# Altium project STM32_Project_1.PrjPcb
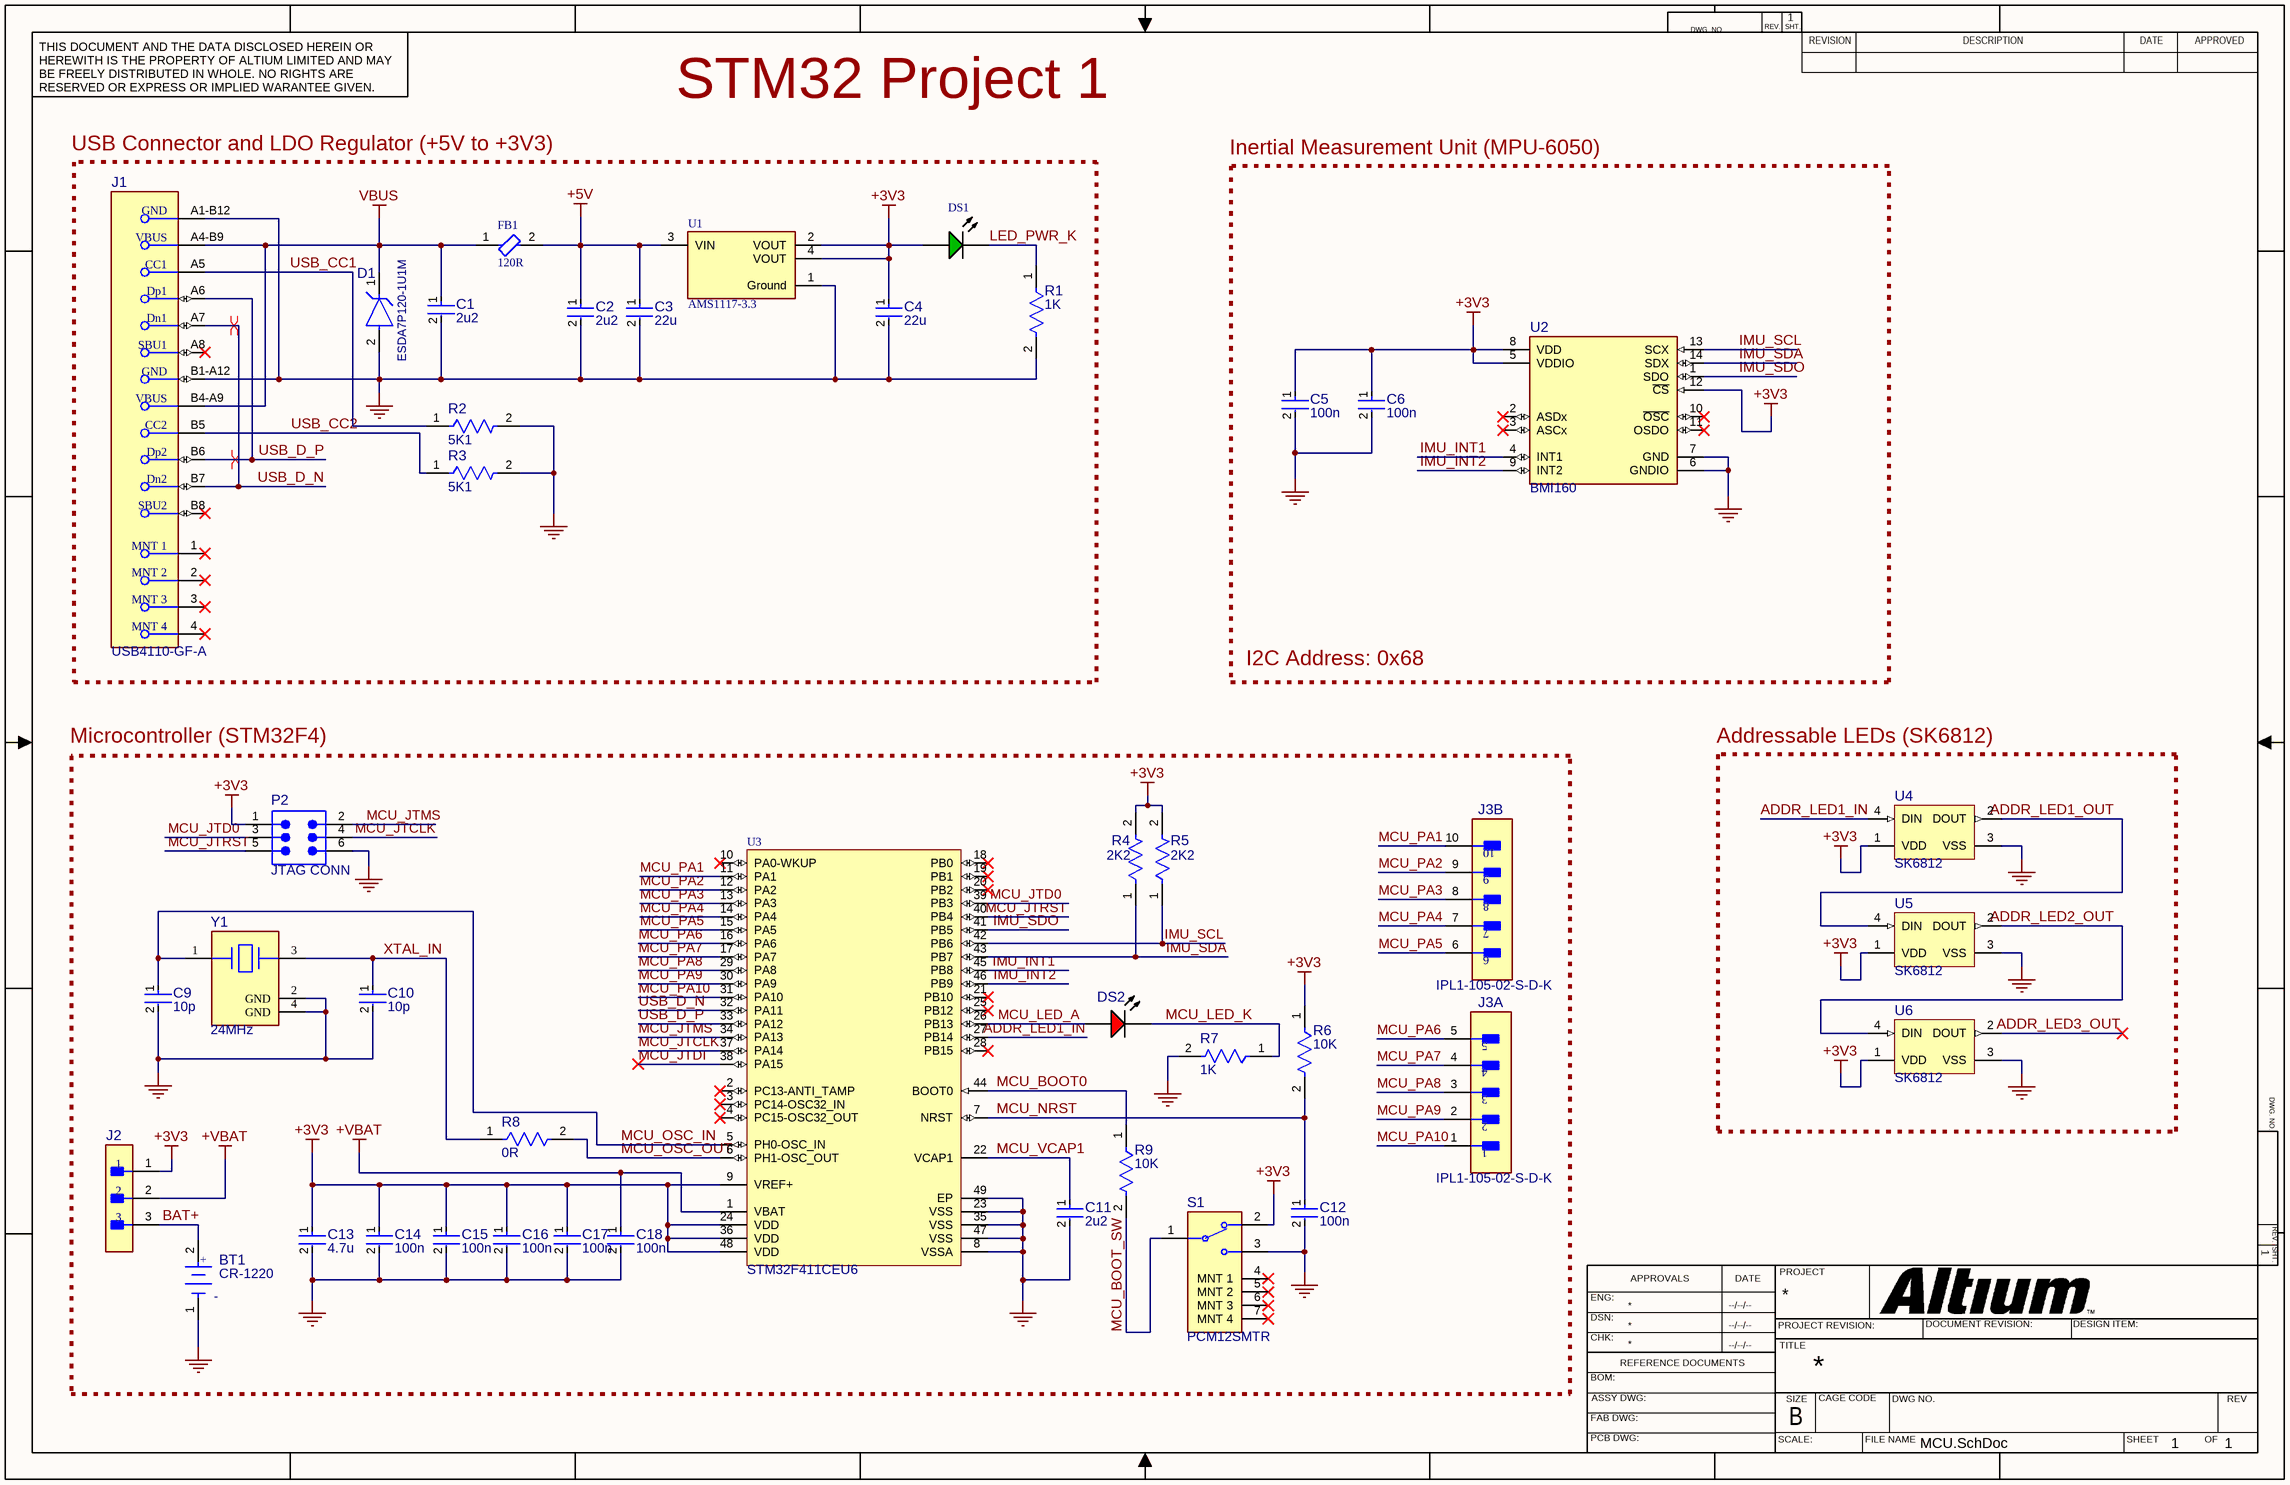
[diagram p0: MCU.SchDoc]
1 sheet, 42 parts. Net scope: global (net labels, ports and power ports of the same name join across sheets).
Board file: PCB1.PcbDoc

## Sheet MCU.SchDoc
size 431 x 279 mm; Author: Ibrahim Oladepo; Revision: -; SheetNumber: 1; SheetTotal: 1; ENG_APP_DATE: --/--/--; DSN_APP_DATE: --/--/--; CHK_APP_DATE: --/--/--

### Parts
BT1  CR-1220  [FP-S8411-45R-MFG]
C1  2u2  [FP-0805-L_2_01_0_2-W_1_25-IPC_B]
C2  2u2  [FP-0805-L_2_01_0_2-W_1_25-IPC_B]
C3  22u  [FP-CC0805-0_85-MFG]
C4  22u  [FP-CC0805-0_85-MFG]
C5  100n  [FP-CC0805-0_85-MFG]
C6  100n  [FP-CC0805-0_85-MFG]
C9  10p  [FP-CC0805-0_85-MFG]
C10  10p  [FP-CC0805-0_85-MFG]
C11  2u2  [FP-0805-L_2_01_0_2-W_1_25-IPC_B]
C12  100n  [FP-CC0805-0_85-MFG]
C13  4.7u  [FP-0805-L_2_01_0_2-W_1_25-MFG]
C14  100n  [FP-CC0805-0_85-MFG]
C15  100n  [FP-CC0805-0_85-MFG]
C16  100n  [FP-CC0805-0_85-MFG]
C17  100n  [FP-CC0805-0_85-MFG]
C18  100n  [FP-CC0805-0_85-MFG]
D1  ESDA7P120-1U1M  [FP-QFN1610-MFG]
DS1  1K  [AVAG-HSMX-C170_V]  (value not drawn)
DS2  LTST-C170KRKT  [LTST-C170KRKT_V]  (value not drawn)
FB1  120R  [FP-BLM21-0_2-t0_85-e0_5-IPC_A]
J1  USB4110-GF-A  [FP-USB4110-GF-A-MFG]
J2  5-146128-1  [FP-5-146128-1-MFG]  (value not drawn)
J3  IPL1-105-02-S-D-K  [FP-IPL1-105-02-S-D-K-0]  (parts A,B of 2)
P2  JTAG CONN  [61000621121]
R1  1K  [FP-CRCW0805-e3-IPC_A]
R2  5K1  [FP-CRCW0805-e3-IPC_A]
R3  5K1  [FP-CRCW0805-e3-IPC_A]
R4  2K2  [FP-CRCW0805-e3-IPC_A]
R5  2K2  [FP-CRCW0805-e3-IPC_A]
R6  10K  [FP-CRCW0805-e3-IPC_A]
R7  1K  [FP-CRCW0805-e3-IPC_A]
R8  0R  [FP-CRCW0805-e3-IPC_A]
R9  10K  [FP-CRCW0805-e3-IPC_A]
S1  PCM12SMTR  [FP-PCM12SMTR-MFG]
U1  AMS1117-3.3  [FP-AMS1117-IPC_C]
U2  BMI160  [FP-BMI160-MFG]
U3  STM32F411CEU6  [STM-UFQFPN48_L]
U4  SK6812  [ADA-RGB-1655_V]
U5  SK6812  [ADA-RGB-1655_V]
U6  SK6812  [ADA-RGB-1655_V]
Y1  24MHz  [FP-ABM8G-MFG]

### Blocks framed on the sheet
USB Connector and LDO Regulator (+5V to +3V3): C1-C4 D1 DS1 FB1 J1 R1-R3 U1
Microcontroller (STM32F4): BT1 C9-C18 DS2 J2 J3 P2 R4-R9 S1 U3 Y1
Addressable LEDs (SK6812): U4-U6

### Nets
+3V3: C4.1 C5.1 C6.1 C13.1 C14.1 C15.1 C16.1 C17.1 DS1.1(A) J2.1 P2.1 R4.2 R5.2 R6.1 S1.2 U1.2(VOUT) U1.4(VOUT) U2.5(VDDIO) U2.8(VDD) U2.12(~{CS}) U3.9(VREF+) U3.24(VDD) U3.36(VDD) U3.48(VDD) U4.1(VDD) U5.1(VDD) U6.1(VDD)
+5V: C2.1 C3.1 FB1.2 U1.3(VIN)
+VBAT: C18.1 J2.2 U3.1(VBAT)
GND: BT1.1(C) C1.2 C2.2 C3.2 C4.2 C5.2 C6.2 C9.2 C10.2 C11.2 C12.2 C13.2 C14.2 C15.2 C16.2 C17.2 C18.2 D1.2(A) J1.A1-B12(GND) J1.B1-A12(GND) P2.6 R1.2 R2.2 R3.2 R7.2 S1.3 U1.1(Ground) U2.6(GNDIO) U2.7(GND) U3.8(VSSA) U3.23(VSS) U3.35(VSS) U3.47(VSS) U3.49(EP) U4.3(VSS) U5.3(VSS) U6.3(VSS) Y1.2(GND) Y1.4(GND)
VBUS: C1.1 D1.1(C) FB1.1 J1.A4-B9(VBUS) J1.B4-A9(VBUS)
ADDR_LED1_IN: U3.27(PB14) U4.4(DIN)
ADDR_LED1_OUT: U4.2(DOUT) U5.4(DIN)
ADDR_LED2_OUT: U5.2(DOUT) U6.4(DIN)
ADDR_LED3_OUT: U6.2(DOUT)
BAT+: BT1.2(A) J2.3
IMU_INT1: U2.4(INT1) U3.45(PB8)
IMU_INT2: U2.9(INT2) U3.46(PB9)
IMU_SCL: R5.1 U2.13(SCX) U3.42(PB6)
IMU_SDA: R4.1 U2.14(SDX) U3.43(PB7)
IMU_SDO: U2.1(SDO) U3.41(PB5)
LED_PWR_K: DS1.2(K) R1.1
MCU_BOOT0: R9.1 U3.44(BOOT0)
MCU_BOOT_SW: R9.2 S1.1
MCU_JTCLK: P2.4 U3.37(PA14)
MCU_JTD0: P2.3 U3.39(PB3)
MCU_JTDI: U3.38(PA15)
MCU_JTMS: P2.2 U3.34(PA13)
MCU_JTRST: P2.5 U3.40(PB4)
MCU_LED_A: DS2.1(A) U3.26(PB13)
MCU_LED_K: DS2.2(K) R7.1
MCU_NRST: C12.1 R6.2 U3.7(NRST)
MCU_OSC_IN: C9.1 U3.5(PH0-OSC_IN) Y1.1
MCU_OSC_OUT: R8.2 U3.6(PH1-OSC_OUT)
MCU_PA1: J3.10 U3.11(PA1)
MCU_PA2: J3.9 U3.12(PA2)
MCU_PA3: J3.8 U3.13(PA3)
MCU_PA4: J3.7 U3.14(PA4)
MCU_PA5: J3.6 U3.15(PA5)
MCU_PA6: J3.5 U3.16(PA6)
MCU_PA7: J3.4 U3.17(PA7)
MCU_PA8: J3.3 U3.29(PA8)
MCU_PA9: J3.2 U3.30(PA9)
MCU_PA10: J3.1 U3.31(PA10)
MCU_VCAP1: C11.1 U3.22(VCAP1)
USB_CC1: J1.A5(CC1) R2.1
USB_CC2: J1.B5(CC2) R3.1
USB_D_N: J1.A7(Dn1) J1.B7(Dn2) U3.32(PA11)
USB_D_P: J1.A6(Dp1) J1.B6(Dp2) U3.33(PA12)
XTAL_IN: C10.1 R8.1 Y1.3

Not connected (* = marked no-connect by the designer): J1 1(MNT_1)* 2(MNT_2)* 3(MNT_3)* 4(MNT_4)* A8(SBU1)* B8(SBU2)*; S1 4(MNT_1)* 5(MNT_2)* 6(MNT_3)* 7(MNT_4)*; U2 2(ASDx)* 3(ASCx)* 10(~{OSC})* 11(OSDO)*; U3 2(PC13-ANTI_TAMP)* 3(PC14-OSC32_IN)* 4(PC15-OSC32_OUT)* 10(PA0-WKUP)* 18(PB0)* 19(PB1)* 20(PB2)* 21(PB10)* 25(PB12)* 28(PB15)*

### Layout directives
differential pair; net class DIFF_USB: USB_D_N, USB_D_P

### Notes on the sheet
- STM32 Project 1
- Inertial Measurement Unit (MPU-6050)
- I2C Address: 0x68
- DWG. NO.
- REV.
- SHT.
- THIS DOCUMENT AND THE DATA DISCLOSED HEREIN OR HEREWITH IS THE PROPERTY OF ALTIUM LIMITED AND MAY BE FREELY DISTRIBUTED IN WHOLE. NO RIGHTS ARE RESERVED OR EXPRESS OR IMPLIED WARANTEE GIVEN.
- REVISION
- DESCRIPTION
- DATE
- APPROVED
- ENG:
- APPROVALS
- PROJECT
- DSN:
- CHK:
- REFERENCE DOCUMENTS
- PROJECT REVISION:
- TITLE
- DOCUMENT REVISION:
- DESIGN ITEM:
- BOM:
- FAB DWG:
- PCB DWG:
- ASSY DWG:
- SCALE:
- SIZE
- B
- CAGE CODE
- FILE NAME
- DWG NO.
- SHEET
- OF
- REV
- (in symbol CMP-15817-000007-1) +; -

### Library data of the parts
BT1 = CMP-15817-000007-1: BATTERY HOLDER COIN 12MM SMD; Number of Batteries: 1; Material: Polyphenylene; Case/Package: SMD/SMT; Number of Cells: 1; Min Operating Temperature: -55°C; Termination: SMD/SMT; REACH SVHC: No SVHC; Contact Plating: Bronze; Package Quantity: 500; Max Operating Temperature: 105°C; Mount: Surface Mount; Packaging: Tape and Reel
C1 C2 C11 = CMP-2000-05810-2: General Purpose Ceramic Capacitor, 0805, 2.2uF, 10%, X5R, 15%, 10V; Insulation Resistance: 500MR; Dissipation Factor: 5%; Termination: SMD/SMT; Length: 2.01mm; Lead Free: Lead Free; Voltage: 10V; Height: 1.4mm; Contact Plating: Tin; Dielectric: X5R; Voltage Rating (DC): 10V; REACH SVHC: No SVHC; Voltage Rating: 10V; Depth: 1.25mm; Min Operating Temperature: -55°C; Tolerance: 10%; Case Code (Metric): 2012; Max Operating Temperature: 85°C; Radiation Hardening: No; Dielectric Material: Ceramic; Packaging: Tape and Reel; Construction: Flat; Case Code (Imperial): 0805; RoHS Compliant: Yes; Package Quantity: 1; Capacitance: 2.2uF; Series: -; Size: 1.4mm; Number of Pins: 2; Width: 0.049inch; Mount: Surface Mount; Thickness: 0.055inch; Case/Package: 0805
C3-C6 C9 C10 C12 C14-C18 = CMP-1036-04402-6: CAP CER 0.1UF 16V X7R 0805; Manufacturer Part Number: CC0805KRX7R7BB104; Manufacturer: Yageo; Material: Ceramic; Tolerance: 0.1; Capacitance: 100 nF; Value: 100 nF; Temperature: -30°C to +85°C; Lead Free: Yes; Footprint Url: http://www.yageo.com/exep/pages/download/literatures/UPY-C_GEN_24.pdf; Voltage Rating: 16 V; Package: CC0805-0.85; RoHS: TRUE; Digikey Description: CAP CER 0.1UF 16V X7R 0805; Category: Cap; Octopart: https://octopart.com/cc0805krx7r7bb104-yageo-39467769; Device Class L3: Ceramic Capacitors; ComponentLink2URL: http://www.yageo.com/documents/recent/UPY-GPHC_Y5V_6.3V-to-50V_8.pdf; Temperature Range Low: -30°C; Mouser Description: Multilayer Ceramic Capacitors MLCC - SMD/SMT 100nF 16V X7R 10%; Automotive: No; Device Class L2: Capacitors; Height: 0.95mm; ComponentLink2Description: Datasheet; Temperature Characteristic: X7R; Ipc Land Pattern Name: CAPC200125X85; Device Class L1: Passive Components; Temperature Range High: +85°C
C13 = CMP-2007-04518-2: General Purpose Ceramic Capacitor, 0805, 4.7uF, 10%, X7R, 15%, 16V; Dissipation Factor: 3.5%; Voltage: 10V; Height: 1.52mm; Package Quantity: 1; Voltage Rating: 16V; RoHS Compliant: Yes; Mount: Surface Mount; REACH SVHC: No SVHC; Number of Pins: 2; Packaging: Tape and Reel; Radiation Hardening: No; Thickness: 0.06inch; Width: 0.049inch; Length: 2.01mm; Termination: SMD/SMT; Case Code (Metric): 2012; Max Operating Temperature: 125°C; Construction: Flat; Series: -; Depth: 1.25mm; Voltage Rating (DC): 16V; Dielectric: X7R; Contact Plating: Tin; Tolerance: 10%; Capacitance: 4.7uF; Lead Free: Lead Free; Min Operating Temperature: -55°C; Case Code (Imperial): 0805; Case/Package: 0805
D1 = CMP-12225-000042-1: TVS DIODE 5.5V 11.5V 1610; Manufacturer: STMicroelectronics; Standoff Height: 0.02mm; Direction: Unidirectional; Max Junction Temp: +150°C; Breakdown Voltage: 6.4V; Number Of Channels: 1; Peak Pulse Power: 1400W; Clamping Voltage: 11V; Peak Pulse Current: 120A; Category: Diode; Automotive: No; Manufacturer Part Number: ESDA7P120-1U1M; Digikey Description: TVS DIODE 5.5V 11.5V 1610; ComponentLink2Description: Datasheet; Package: QFN1610; Reverse Standoff Voltage: 5.5V; ComponentLink2URL: https://www.st.com/resource/en/datasheet/esda7p120-1u1m.pdf; Device Class L3: unset; Temperature: -55°C to +150°C; RoHS: TRUE; Height: 0.6mm; Device Class L1: Circuit Protection; Temperature Range Low: -55°C; Octopart: https://octopart.com/esda7p120-1u1m-stmicroelectronics-80927196; Lead Free: Yes; Temperature Range High: +150°C; Device Class L2: TVS Diodes
DS1 = CMP-2000-05062-1: Chip LED, Green, 2.2 V, -40 to 85 degC, 2-Pin SMD, Pb-Free, Tape and Reel; Manufacturer: Avago; No. of Pins: 2; Peak Wavelength: 570nm; SVHC: NoSVHC(16-Jun-2014); Dominant Wavelength: 572nm; Forward Current If: 20mA; Viewing Angle: 170deg; Lens Shape: Rectangular; PIV Max: 5V; External Width: 1.25mm; LED Type: Standard; External Depth: 0.8mm; Opto Mounting Orientation: Top; Luminous Intensity: 15mcd; Luminous Intensity Min: 4mcd; Forward Voltage VF Max: 2.6V; External Length / Height: 2mm; Bulb Size: 1.25mmx1.4mm; Light Area Height: 1mm; Voltage Vf Typ: 2.2V; Operating Temperature Max: 85degC; Datasheet Version: Oct-08; MSL: MSL2A-4weeks; Peak Forward Current: 20mA; Package Description: 2-Pin Surface Mount Device, Body 2 x 1.25 mm, Height 0.8 mm; Datasheet URL: https://datasheet.ciiva.com/29280/180495-da-01-en-chip-led-hsmg-c170-gelb-gruen-29280971.pdf; Storage Temperature Min: -40degC; LED Colour: Green; Wavelength Typ: 570nm; Mounting Type: SMD; Forward Current If Max: 20mA; Dominant Wavelength Typ: 572nm; LED Mounting: SMD; Operating Temperature Range: -30degCto+85degC; Operating Temperature Min: -30degC; Manufacturer URL: http://www.avagotech.com/; Packaging: CutTape; Luminous Intensity Typ: 15mcd; Package Reference: HSMX-C170; Storage Temperature Max: 85degC; Opto Case Style: SMD; Forward Voltage: 2.2V
DS2 = CMP-2000-07593-1: LED Red, 75 mW, 54 mcd, -55 to 85 degC, 2-Pin SMD, RoHS, Tape and Reel; Manufacturer: Lite-On; Lens Transparency: Clear; Number of Elements: 1; Power Rating: 75mW; Luminous Intensity: 54mcd; Viewing Angle: 130degrees; Forward Current: 30mA; Wavelength: 639nm; Lens Style: Rectangular; Case\/Package: 0805; Test Current: 20mA; Dominant Wavelength: 631nm; Forward Voltage: 2V; Lens Colour: Colorless; Min Operating Temperature: -55degC; RoHSCompliant: True; Length: 3.2mm; Width: 1.25mm; Mount: SurfaceMount; Packaging: TapeandReel; Number of LEDs: 1; Radiation Hardening: No; Datasheet URL: http://optoelectronics.liteon.com/upload/download/DS-22-99-0150/LTST-C170KRKT.pdf; Datasheet Version: Rev. D, 11/2014; Case Code (Metric): 2012; Height: 1.1mm; Number of Pins: 2; Package Description: 2-Pin Surface Mount Device, Body 2 x 1.25 mm; Manufacturer URL: http://www.us.liteon.com/; Lead Free: LeadFree; Illumination Colour: Red; Colour: Red; Case Code (Imperial): 0805; Max Operating Temperature: 85degC; Power Dissipation: 75mW; Mounting Technology: SurfaceMount; Package Reference: C170KRKT; Package Quantity: 1; Depth: 1.6mm
FB1 = CMP-0686-00716-3: FERRITE BEAD 120 OHM 0805 1LN; Number of Lines: 1; DC Resistance-Max: 100mR; Material: Steel; Max DC Current: 200mA; Shielding: Unshielded; Test Frequency: 100MHz; Current Rating: 800mA; Max Current Rating: 1A; Resistance: 150mR; Tolerance: 25%; Width: 1.25mm; Number of Circuits: 1; Military Standard: Not; Height: 0.85mm; Series: BLM21A; Min Operating Temperature: -55°C; DC Resistance (DCR): 100mR; Termination: SMD/SMT; Impedance: 120R; Core Material: Ferrite; REACH SVHC: No SVHC; Radiation Hardening: No; Max Operating Temperature: 125°C; Number of Pins: 2; Case/Package: 0805; Case Code (Imperial): 0805; Frequency: 100MHz; Depth: 1.25mm; Length: 2mm; DC Current: 200mA; Lead Free: Lead Free; Case Code (Metric): 2012; Package Quantity: 1; Packaging: Tape and Reel
J1 = CMP-245163-000002-1: CONN USB 2.0 TYPE-C R/A SMT; Manufacturer: GCT; Conn Orientation: Right Angle; Usb Standard: USB 2.0; Voltage Rating: 20V; Current Rating: 3/4.25/1.25/0.25A; Number Of Contacts: 16; Is Female: yes; Shielding: true; Standoff Height: 0.1mm; Octopart: https://octopart.com/usb4110-gf-a-gct-103941985; Temperature: -40°C to +85°C; RoHS: TRUE; Automotive: No; Contact Material: Gold,Nickel; Device Class L1: Connectors; Device Class L2: USB Connectors; Package: 0; Lead Free: Yes; ComponentLink2URL: https://gct.co/files/drawings/usb4110.pdf; Temperature Range High: +85°C; Temperature Range Low: -40°C; Height: 3.46mm; Manufacturer Part Number: USB4110-GF-A; ComponentLink2Description: Datasheet; Device Class L3: unset; Digikey Description: CONN USB 2.0 TYPE-C R/A SMT; Category: Conn
J2 = CMP-03369-000030-1: CONN HEADER SMD 3POS 2.54MM; Manufacturer: TE; Conn Gender: Male; Number Of Contacts: 3; Current Rating: 3A; Conn Orientation: Straight; Voltage Rating: 30V; Temperature Range Low: -65°C; Device Class L1: Connectors; Mouser Description: AMPMODU 3 Position Surface Mount Single Row Straight 2.54 mm Breakaway Header; Automotive: No; Temperature Range High: +125°C; Temperature: -65°C to +125°C; Device Class L2: Headers and Wire Housings; Pitch: 2.54mm; ComponentLink2Description: Datasheet; Category: Conn; Digikey Description: CONN HEADER SMD 3POS 2.54MM; ComponentLink2URL: https://www.te.com/global-en/product-5-146128-1.html; Contact Material: Gold,Nickel; Device Class L3: unset; Package: HDR3; Footprint Url: https://www.te.com/commerce/DocumentDelivery/DDEController?Action=srchrtrv&DocNm=146128&DocType=Customer+Drawing&DocLang=English; Octopart: https://octopart.com/5-146128-1-te+connectivity-40948200; Number Of Rows: 1; Height: 10.1092mm; Manufacturer Part Number: 5-146128-1; RoHS: TRUE; Lead Free: Yes
J3 = CMP-02766-000388-1: 5 Position 2 Row .100" (2.54 mm) pitch connector; Max Current Rating: 7.4A; Gender: Male; Number of Terminals/Pins: 10; Pitch: 2.54mm; Row Spacing: 0.1inch; Number of Ports: 1; Connector Type: Male Pin; Packaging: Rail/Tube; Length: 14.22mm; Number of Rows: 2; Fastening Type: Ramp; Contact Material: Bronze; Number of Contacts: 10; Color: Natural; Contact Plating: Gold; Orientation: Straight; Max Operating Temperature: 125°C; Contact Mating Length: 0.215inch; Termination: Solder; Package Quantity: 1; Min Operating Temperature: -55°C; Radiation Hardening: No; Number of Positions: 10; Housing Material: Polymer; Mount: Surface Mount
P2 = CMP-1502-01024-2: NexarPartId: 32855428; Row Spacing: 2.54mm; Number of Contacts: 6; Contact Resistance: 20mΩ; Operating Supply Voltage: 250V; Current Rating: 3A; Gender: Male; Connector Type: Male Pin; Lead Pitch: 2.54mm; Mount: Surface Mount; REACH SVHC: Unknown; Contact Plating: Gold; Color: Black; Contact Mating Length: 5.9944mm; RoHS: Compliant; Orientation: Vertical; Contact Material: Copper; Pitch: 2.54mm; Termination: Solder; Number of Pins: 6; Number of Positions: 6; Number of Rows: 2
R1-R9 = CMP-2001-04908-2: RES Thick Film, 10kΩ, 1%, 0.125W, 100ppm/°C, 0805; Resistance: 10kR; Voltage Rating (DC): 150V; Power Rating: 125mW; Weight: 0.000194oz; Package Quantity: 5000; Military Standard: Not; Max Operating Temperature: 155°C; Temperature Coefficient: 100ppm/°C; Contact Plating: Tin; Width: 1.25mm; Height: 0.45mm; Radiation Hardening: No; Tolerance: 1%; Min Operating Temperature: -55°C; Voltage Rating: 150V; Length: 2mm; Depth: 1.25mm; Termination: SMD/SMT; Packaging: Tape and Reel; Case/Package: 0805; Case Code (Metric): 2012; Lead Free: Lead Free; Case Code (Imperial): 0805; Composition: Thick Film
S1 = CMP-2000-06884-2: SWITCH SLIDE SPDT 300MA 6V; Actuator Material: Nylon; Switch Function: On-On; Insulation Resistance: 100mR; Actuator Type: Standard; Mechanical Life: 10000Cycles; Actuator Length: 1.5mm; Contact Resistance: 70mR; Min Operating Temperature: -20°C; Max Current Rating: 300mA; Max Voltage Rating (DC): 6V; Package Quantity: 1; Mount: Surface Mount; Packaging: Tape and Reel; Contact Plating: Silver; Depth: 5mm; REACH SVHC: No SVHC; Voltage Rating (DC): 6V; Voltage Rating (AC): 6V; Max Operating Temperature: 85°C; Length: 7.7mm; Termination: Gull Wing; Current Rating: 300mA; Contact Current Rating: 300mA; Orientation: Right Angle; Width: 6.7mm; Switch Travel: 1.5mm; Lead Free: Lead Free; Contact Material: Copper Alloy; Throw Configuration: SPDT
U1 = CMP-209535-000001-1: LDO Voltage Regulators 1A, 3.3V; Manufacturer: Advanced Monolithic Systems; Dropout Voltage: 1.1V; Output Type: Fixed; Nominal Supply Current: 5mA; Max Power Dissipation: 1.2W; Max Supply Voltage: 15V; Number Of Outputs: 1; Standoff Height: 0.64mm; Max Junction Temp: +125°C; Height: 1.8mm; Package: AMS1117; Device Class L2: Power Management ICs; ComponentLink2Description: Datasheet; ComponentLink2URL: http://www.advanced-monolithic.com/pdf/ds1117.pdf; Category: IC; RoHS: TRUE; Automotive: No; Device Class L1: Integrated Circuits (ICs); Output Current: 1A; Device Class L3: Voltage Regulators - Linear; Temperature: -40°C to +125°C; Output Voltage: 3.3V; Manufacturer Part Number: AMS1117-3.3; Temperature Range Low: -40°C; Octopart: https://octopart.com/ams1117-3.3-advanced+monolithic+systems-25899300; Lead Free: Yes; Ipc Land Pattern Name: SOT229P700X180-4; Temperature Range High: +125°C
U2 = CMP-2000-07537-3: IMU ACCEL/GYRO I2C/SPI 14LGA; Sensor Type: Accelerometer; Output Type: SPI; Mount: Surface Mount; Max Operating Temperature: 85°C; Case/Package: LGA; Min Operating Temperature: -40°C; Packaging: Cut Tape; Lead Free: Lead Free
U3 = CMP-0243-00165-1: ARM Cortex-M4 32-bit MCU+FPU, 512 KB Flash, 128 KB RAM, 36 I/Os, 48-Pin UFQFPN, -40 to 85 degC, Tray; Operating Frequency(F) (Processor speed) (MHz): 100; FLASH Size (Prog) (kB): 512; Internal RAM Size (kB): 128; I/Os (High Current): 36; Supply Voltage(Vcc) min (V): 1.7; Package Reference: 48-Pin Ultra Thin Fine Pitch Quad Flat No-Lead, 7 x 7 x 0.6 mm Body, 0.5 mm Pitch, Exposed Pad; ComponentLink1Description: Manufacturer URL; ComponentLink1URL: http://www.st.com/; Packing: Tray; Package Description: UFQFPN48; Core: ARM Cortex-M4; ComponentLink2Description: Datasheet; ComponentLink2URL: http://www.st.com/st-web-ui/static/active/en/resource/technical/document/datasheet/DM00115249.pdf; DatasheetVersion: Rev. 6; Mounting Technology: Surface Mount
U4-U6 = CMP-2000-05026-1: Intelligent Control LED Integrated Light Source, 3.5 to 5.3 V, -25 to 80 degC, 4-Pin SMD, RoHS, Tape and Reel; Manufacturer: Adafruit-Industries-LLC; Number of LEDs: 10; Configuration: Discrete; Utilized LED: WS2812(5050); Datasheet URL: http://datasheet.octopart.com/ADA1655-Adafruit-Industries-datasheet-32028139.pdf; Series: Neopixel; Interface: -; Package Description: 4-Pin Surface Mount Device, Body 5 x 5 mm; Color: Red,Green,Blue(RGB); Category: Optoelectronics; Controller Type: -; Package Reference: 1655; Manufacturer URL: https://www.adafruit.com/; Mounting Type: SurfaceMount; Datasheet Version: May-13; Size / Dimension: 5.00mmLx5.00mmW; Family: Addressable,Specialty
Y1 = CMP-27762-015229-1: Crystal 24MHz ±30ppm (Tol) ±30ppm (Stability) 10pF FUND 60Ω 4-Pin SMD T/R; Series Resistance: 60R; Width: 2.5mm; Case/Package: CSMD; Load Capacitance: 10pF; Max Operating Temperature: 70°C; Depth: 2.5mm; Min Operating Temperature: -20°C; Frequency Stability: 30ppm; Frequency Tolerance: 30ppm; Frequency: 24MHz; Length: 3.2mm; Height: 1mm; Mount: Surface Mount; Lead Free: Lead Free; Tolerance: 30ppm; ESR (Equivalent Series Resistance): 60R; Number of Pins: 4; Termination: SMD/SMT; Operating Frequency: 24 MHz; Package Quantity: 1000; Series: ABM8G; Packaging: Tape and Reel